# Altium schematic sheet Power.SchDoc
size A4; SheetNumber: 4; SheetTotal: 5
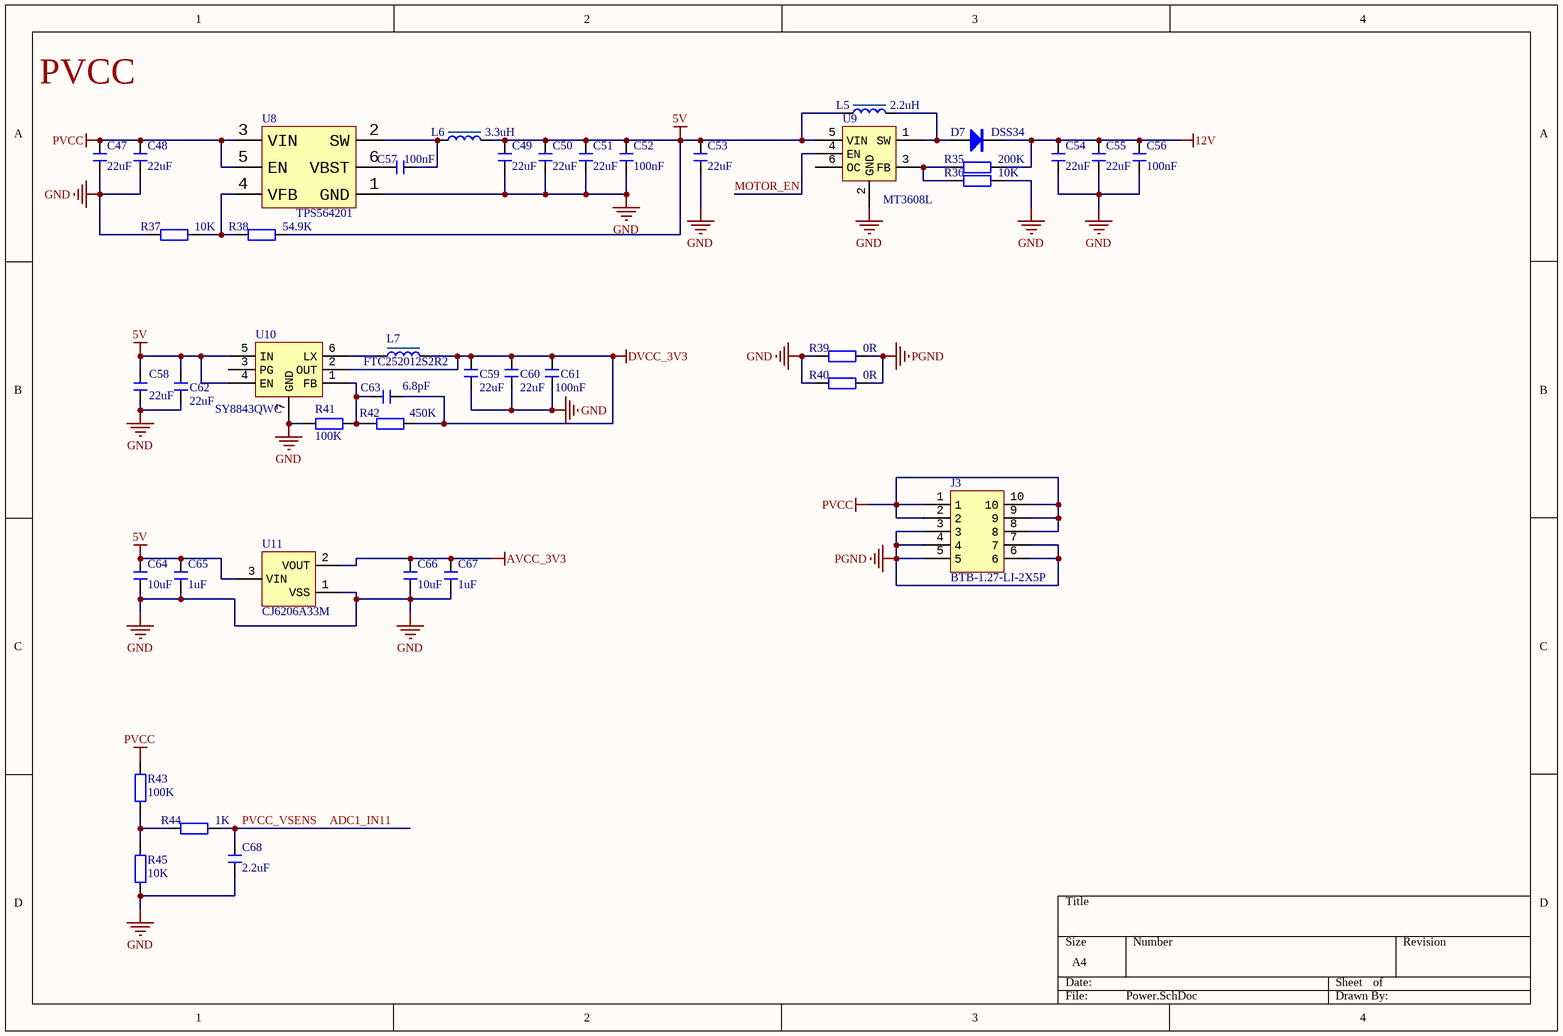
[diagram p0: Power.SchDoc]

## Parts
C47  22uF  [C 1206_L]
C48  22uF  [C 1206_L]
C49  22uF  [C 0603_L]
C50  22uF  [C 0603_L]
C51  22uF  [C 0603_L]
C52  100nF  [C 0402_L]
C53  22uF  [C 0603_L]
C54  22uF  [C 0603_L]
C55  22uF  [C 0603_L]
C56  100nF  [C 0402_L]
C57  100nF  [C 0402_L]
C58  22uF  [C 0603_L]
C59  22uF  [C 0603_L]
C60  22uF  [C 0603_L]
C61  100nF  [C 0402_L]
C62  22uF  [C 0603_L]
C63  6.8pF  [C 0402_L]
C64  10uF  [C 0402_L]
C65  1uF  [C 0402_L]
C66  10uF  [C 0402_L]
C67  1uF  [C 0402_L]
C68  2.2uF  [C 0402_L]
D7  DSS34  [SOD-123FL]
J3  BTB-1.27-LI-2X5P  [1.27-LI-2X5P]
L5  2.2uH  [L-4020]
L6  3.3uH  [L-0630]
L7  FTC252012S2R2  [252012]
R35  200K  [R 0402_L]
R36  10K  [R 0402_L]
R37  10K  [R 0402_L]
R38  54.9K  [R 0402_L]
R39  0R  [R 1206_L]
R40  0R  [R 1206_L]
R41  100K  [R 0402_L]
R42  450K  [R 0402_L]
R43  100K  [R 0402_L]
R44  1K  [R 0402_L]
R45  10K  [R 0402_L]
U8  TPS564201  [SOT23-6L]
U9  MT3608L  [SOT23-6L]
U10  SY8843QWC  [QFN7 1.5X1.5]
U11  CJ6206A33M  [SOT23-3L]

## Nets
5V: C49.2 C50.2 C51.2 C52.2 C53.2 C58.2 C62.2 C64.2 C65.2 L5.1 L6.2 R38.2 U9.5(VIN) U10.4(EN) U10.5(IN) U11.3(VIN)
12V: C54.2 C55.2 C56.2 D7.1(K) R35.2
AVCC_3V3: C66.2 C67.2 U11.2(VOUT)
DVCC_3V3: C59.2 C60.2 C61.2 C63.1 L7.2 R42.1 U10.2(OUT)
GND: C47.1 C48.1 C49.1 C50.1 C51.1 C52.1 C53.1 C54.1 C55.1 C56.1 C58.1 C59.1 C60.1 C61.1 C62.1 C64.1 C65.1 C66.1 C67.1 C68.1 R36.2 R37.1 R39.1 R40.1 R41.2 R45.1 U8.1(GND) U9.2(GND) U10.7(GND) U11.1(VSS)
PGND: J3.3 J3.4 J3.5 J3.6 J3.7 R39.2 R40.2
PVCC: C47.2 C48.2 J3.1 J3.2 J3.8 J3.9 J3.10 R43.2 U8.3(VIN) U8.5(EN)
ADC1_IN11: C68.2 R44.1  [also labelled PVCC_VSENS]
MOTOR_EN: U9.4(EN)
NetC57_1: C57.1 U8.6(VBST)
NetC57_2: C57.2 L6.1 U8.2(SW)
NetC63_2: C63.2 R41.1 R42.2 U10.1(FB)
NetD7_2: D7.2(A) L5.2 U9.1(SW)
NetL7_1: L7.1 U10.6(LX)
NetR35_1: R35.1 R36.1 U9.3(FB)
NetR37_2: R37.2 R38.1 U8.4(VFB)
NetR43_1: R43.1 R44.2 R45.2

Not connected (* = marked no-connect by the designer): U9 6(OC); U10 3(PG)

## Notes on the sheet
- PVCC

## Library data of the parts
C47-C68 = C: 无极性贴片电容; 版权归属: 源创客; BOM名称: 无极性贴片电容; 学习资源: www.ooocke.com
D7 = DSS34: 肖特基二极管
J3 = LI-2X5P
L5-L7 = L-CD: 贴片功率电感; BOM名称: 功率电感; 版权归属: 源创客; 学习资源: www.ooocke.com
R35-R45 = R: 贴片电阻; 版权归属: 源创客; BOM名称: 贴片电阻; 学习资源: www.ooocke.com
U8 = TPS563200: 3A  4.5V-17V输入 同步
U9 = MT3608L: 2.5A 1.5MHZ / 宽输入升压
U10 = SY8843QWC: DC-DC 1.5M / VIN:2.7~5.5V 3A
U11 = LN6206PXXX: 三端稳压芯片 / 6V 250mA